# EAGLE design LTC2495Shield (EAGLE 7.4.0)
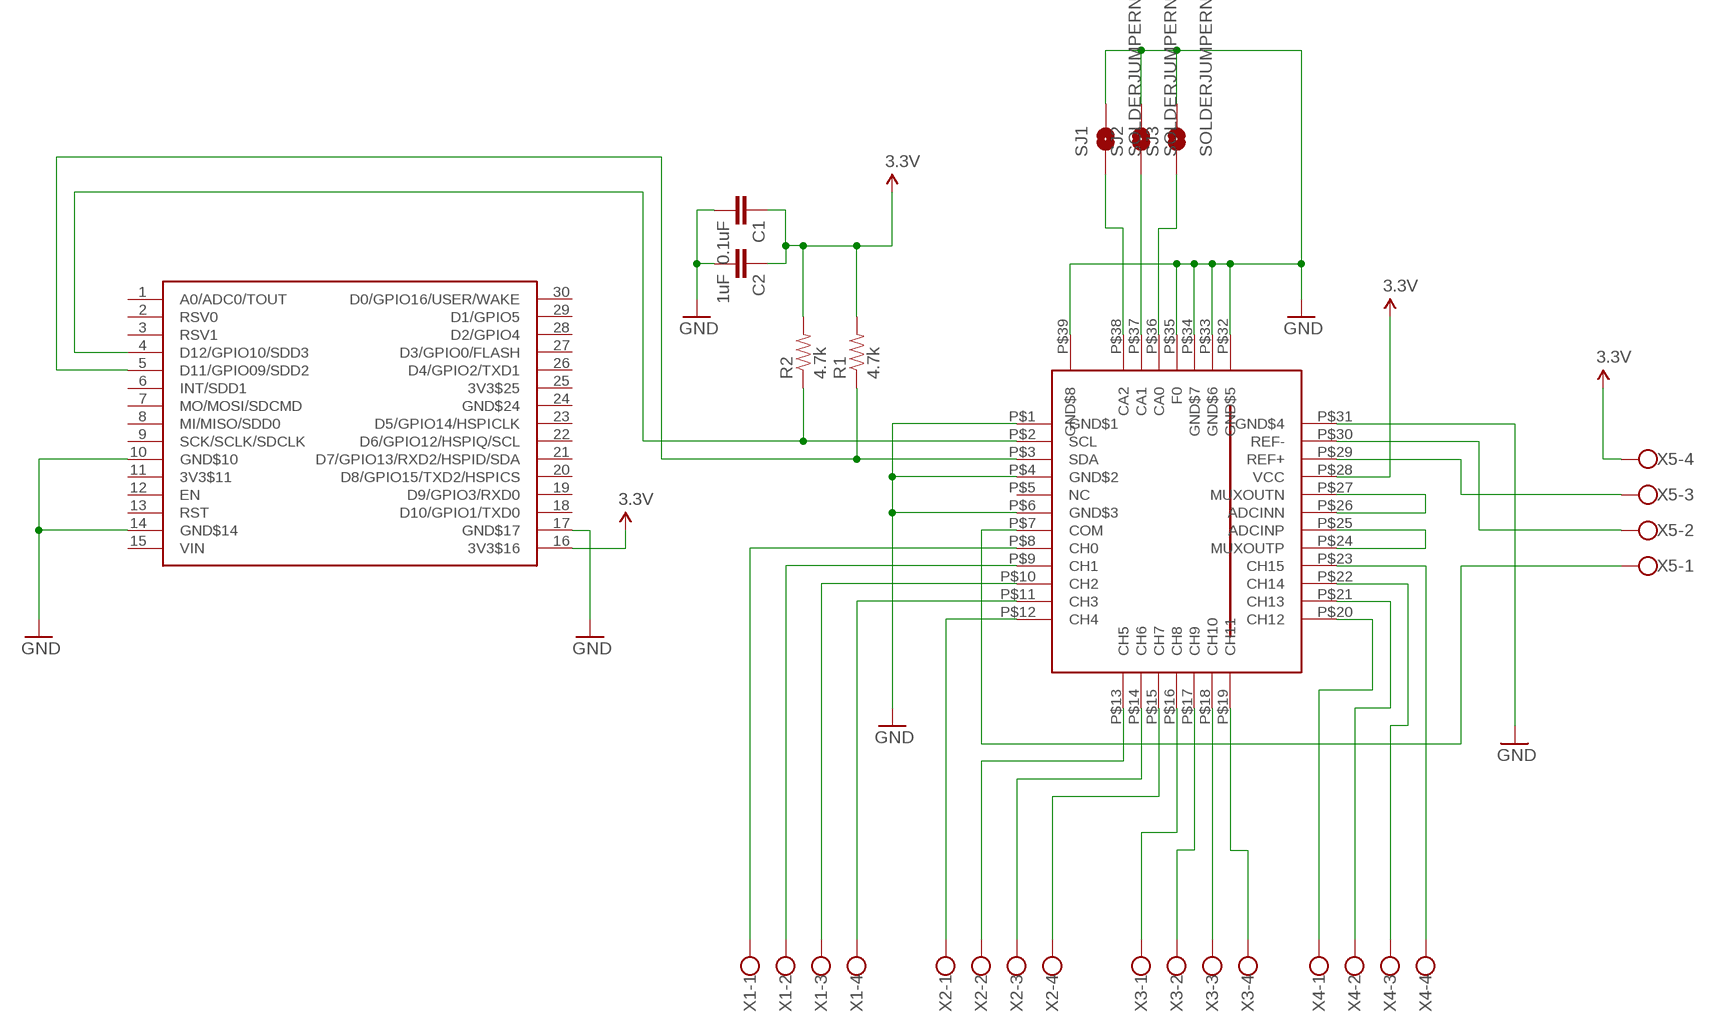
[diagram p0: schematic, sheet 1]

## Parts
C1  0.1uF  CAP0402-CAP  [0402-CAP]
C2  1uF  CAP0402-CAP  [0402-CAP]
R1  4.7k  RESISTOR0402-RES  [0402-RES]
R2  4.7k  RESISTOR0402-RES  [0402-RES]
SJ1  SOLDERJUMPERNO  [SJ_2S-NO]
SJ2  SOLDERJUMPERNO  [SJ_2S-NO]
SJ3  SOLDERJUMPERNO  [SJ_2S-NO]
U$1  NERDSHIELD  [NERDUINO_STACK]
U$3  LTC2495  [UHF38]
X1  W237-4  [W237-4]
X2  W237-4  [W237-4]
X3  W237-4  [W237-4]
X4  W237-4  [W237-4]
X5  W237-4  [W237-4]

## Nets
3.3V: C1.1 C2.1 R1.2 R2.2 U$1.16(3V3$16) U$3.P$28(VCC) X5.4
GND: C1.2 C2.2 SJ1.2 SJ2.2 SJ3.2 U$1.10(GND$10) U$1.14(GND$14) U$1.17(GND$17) U$3.P$1(GND$1) U$3.P$4(GND$2) U$3.P$6(GND$3) U$3.P$31(GND$4) U$3.P$32(GND$5) U$3.P$33(GND$6) U$3.P$34(GND$7) U$3.P$35(F0) U$3.P$39(GND$8)
N$2: R1.1 U$1.5(D11/GPIO09/SDD2) U$3.P$3(SDA)
N$3: U$3.P$8(CH0) X1.1
N$4: U$3.P$9(CH1) X1.2
N$5: U$3.P$10(CH2) X1.3
N$6: U$3.P$11(CH3) X1.4
N$7: U$3.P$12(CH4) X2.1
N$8: R2.1 U$1.4(D12/GPIO10/SDD3) U$3.P$2(SCL)
N$9: U$3.P$13(CH5) X2.2
N$10: U$3.P$14(CH6) X2.3
N$11: U$3.P$15(CH7) X2.4
N$12: U$3.P$16(CH8) X3.1
N$13: U$3.P$17(CH9) X3.2
N$14: U$3.P$18(CH10) X3.3
N$15: U$3.P$19(CH11) X3.4
N$16: U$3.P$20(CH12) X4.1
N$17: U$3.P$21(CH13) X4.2
N$18: U$3.P$22(CH14) X4.3
N$19: U$3.P$23(CH15) X4.4
N$20: SJ1.1 U$3.P$38(CA2)
N$21: SJ2.1 U$3.P$37(CA1)
N$22: SJ3.1 U$3.P$36(CA0)
N$25: U$3.P$7(COM) X5.1
N$26: U$3.P$29(REF+) X5.3
N$27: U$3.P$30(REF-) X5.2
N$28: U$3.P$26(ADCINN) U$3.P$27(MUXOUTN)
N$29: U$3.P$24(MUXOUTP) U$3.P$25(ADCINP)
Unconnected: U$1.1(A0/ADC0/TOUT) U$1.2(RSV0) U$1.3(RSV1) U$1.6(INT/SDD1) U$1.7(MO/MOSI/SDCMD) U$1.8(MI/MISO/SDD0) U$1.9(SCK/SCLK/SDCLK) U$1.11(3V3$11) U$1.12(EN) U$1.13(RST) U$1.15(VIN) U$1.18(D10/GPIO1/TXD0) U$1.19(D9/GPIO3/RXD0) U$1.20(D8/GPIO15/TXD2/HSPICS) U$1.21(D7/GPIO13/RXD2/HSPID/SDA) U$1.22(D6/GPIO12/HSPIQ/SCL) U$1.23(D5/GPIO14/HSPICLK) U$1.24(GND$24) U$1.25(3V3$25) U$1.26(D4/GPIO2/TXD1) U$1.27(D3/GPIO0/FLASH) U$1.28(D2/GPIO4) U$1.29(D1/GPIO5) U$1.30(D0/GPIO16/USER/WAKE) U$3.P$5(NC)

## Library data of the parts
C1 C2 = SparkFun:CAP: Capacitor Standard 0603 ceramic capacitor, and 0.1" leaded capacitor.
R1 R2 = SparkFun:RESISTOR: Resistor Basic schematic elements and footprints for 0603, 1206, and PTH resistors.
SJ1-SJ3 = SparkFun:SOLDERJUMPER: Solder Jumper Standard SMD solder jumper. Used to automate production. Two varients : Normally Open and Normally Closed are the same, but have different paste layers. NC will have a large amount of paste and should jumper during reflow.
U$1 = NerduinoShieldLib:NERDSHIELD
U$3 = SparkFun-AnalogIC:LTC2495
X1-X5 = con-wago-500:W237-4: WAGO SCREW CLAMP; OC_FARNELL: unknown; OC_NEWARK: unknown

## Board
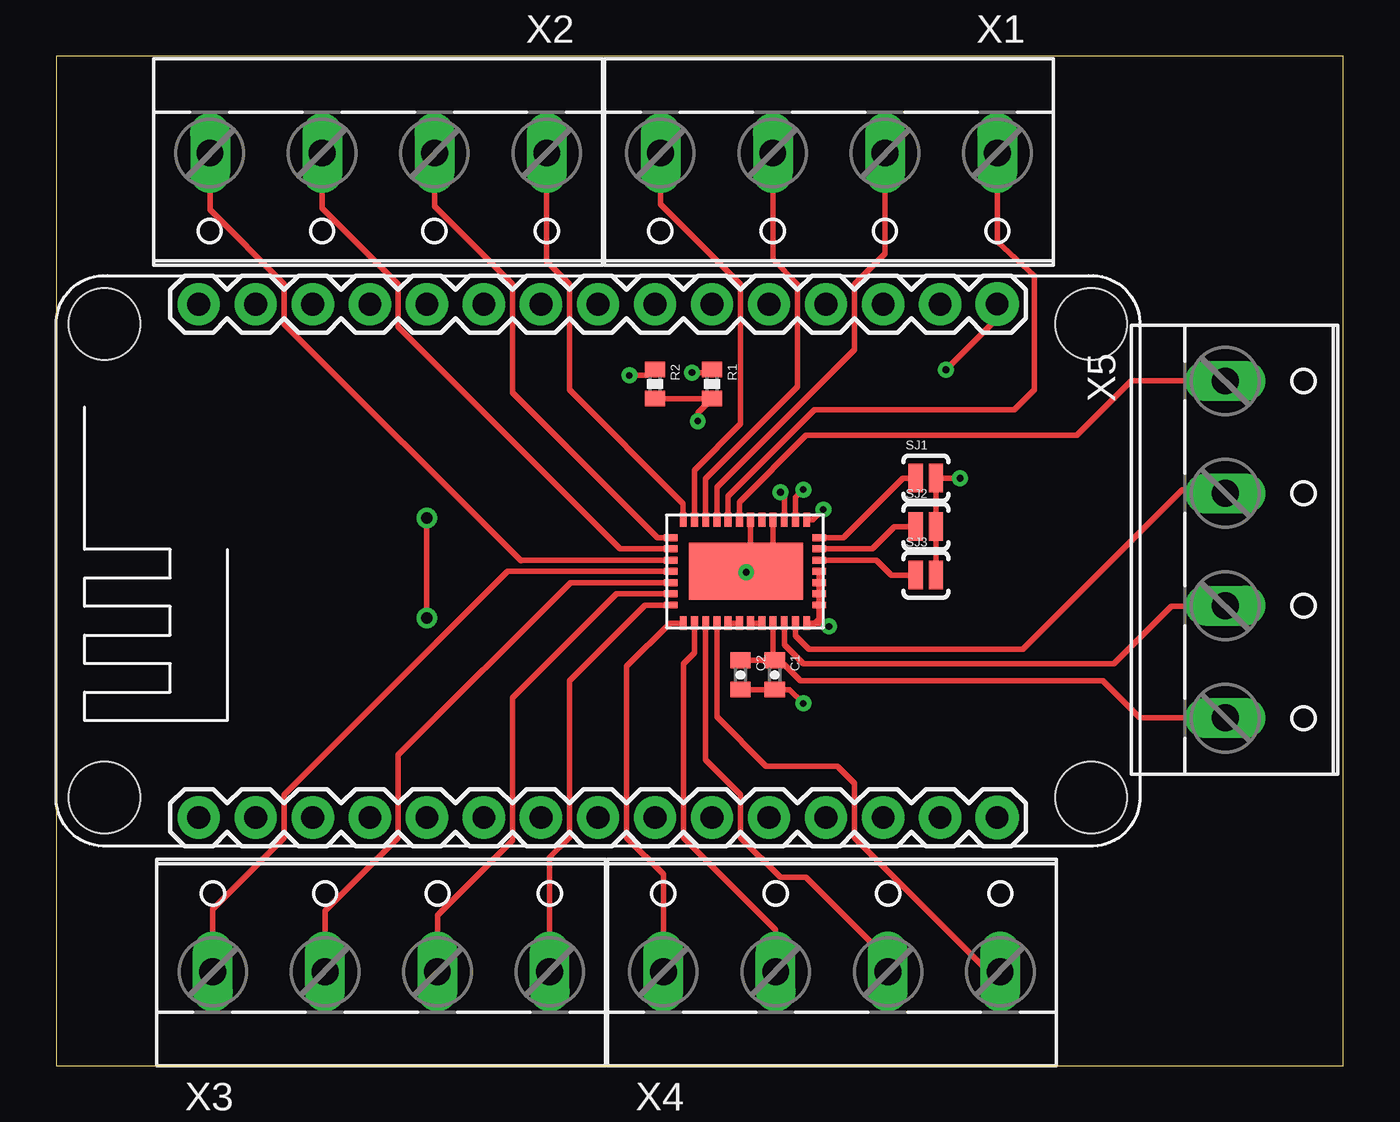
[diagram p1: board, top side]
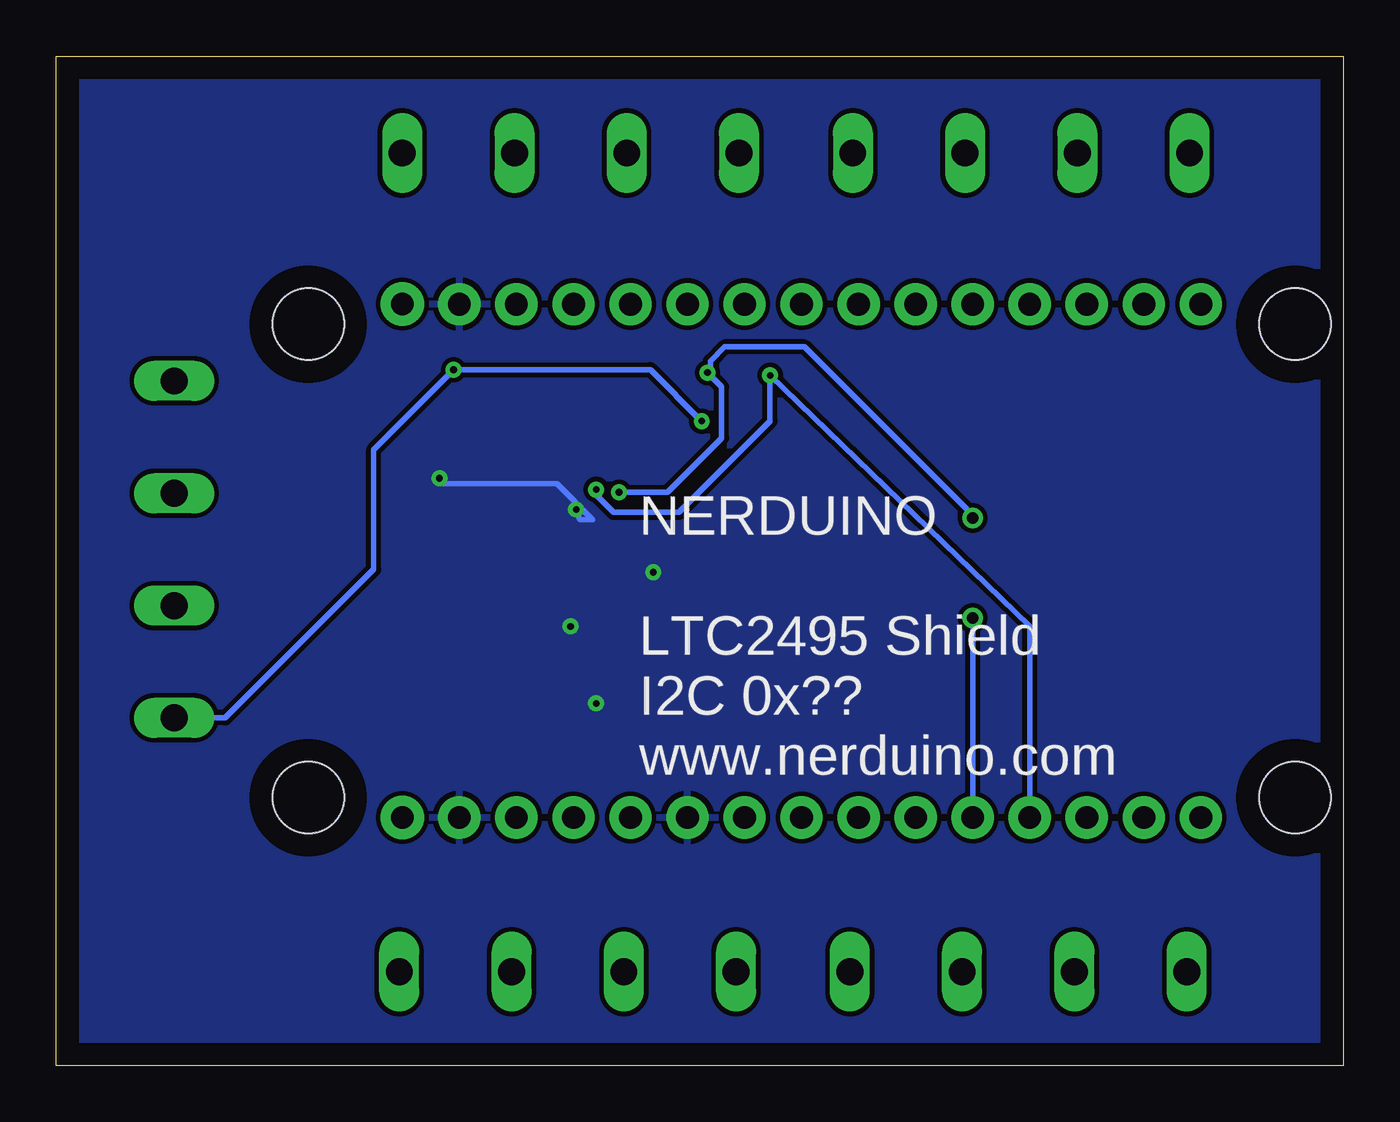
[diagram p2: board, bottom side, seen from below]

Size 57.33 x 44.95 mm. Coordinates in mm from the lower left corner, seen from the top.
Outline: 0,0 57.33,0 57.33,44.95 0,44.95 0,0
Copper layers (1*16): Top 0.035mm / dielectric 1.5mm / Bottom 0.035mm
Design rules "default": minimum track width 10mil, minimum drill 24mil, track to track 8mil, track to pad 8mil, pad to pad 8mil, via to via 8mil, smd to smd 8mil, copper to edge 40mil, drill to drill 8mil, minimum pad ring 10mil, minimum via ring 8mil, stop-mask expansion 4mil, vias tented up to drill 0mil, thermal gap 10mil

### Footprints (pad centres in the part's own frame; a part is rotated, then mirrored left to right if it is on the bottom)
0402-CAP = smd 0.7 x 0.9: 1 -0.65,0; 2 0.65,0
0402-RES = smd 0.7 x 0.9: 1 -0.65,0; 2 0.65,0
SJ_2S-NO = smd 0.635 x 1.27: 1 -0.45,0; 2 0.45,0
NERDUINO_STACK = drill 1.016 pad 1.88: 1 -17.78,-5.08; 2 -15.24,-5.08; 3 -12.7,-5.08; 4 -10.16,-5.08; 5 -7.62,-5.08; 6 -5.08,-5.08; 7 -2.54,-5.08; 8 0,-5.08; 9 2.54,-5.08; 10 5.08,-5.08; 11 7.62,-5.08; 12 10.16,-5.08; 13 12.7,-5.08; 14 15.24,-5.08; 17 15.24,17.78; 18 12.7,17.78; 19 10.16,17.78; 20 7.62,17.78; 21 5.08,17.78; 22 2.54,17.78; 23 0,17.78; 24 -2.54,17.78; 25 -5.08,17.78; 26 -7.62,17.78; 27 -10.16,17.78; 28 -12.7,17.78; 29 -15.24,17.78; 30 -17.78,17.78 | drill 1 pad 1.93: 15 17.78,-5.08; 16 17.78,17.78 | hole 3.175: -21.971,16.891; -21.971,-4.191; 21.971,-4.191; 21.971,16.891
UHF38 = smd 0.61 x 0.305: P$1 0.2,6.25; P$2 0.2,5.75; P$3 0.2,5.25; P$4 0.2,4.75; P$5 0.2,4.25; P$6 0.2,3.75; P$7 0.2,3.25; P$8 0.2,2.75; P$9 0.2,2.25; P$10 0.2,1.75; P$11 0.2,1.25; P$12 0.2,0.75; P$20 4.8,0.75; P$21 4.8,1.25; P$22 4.8,1.75; P$23 4.8,2.25; P$24 4.8,2.75; P$25 4.8,3.25; P$26 4.8,3.75; P$27 4.8,4.25; P$28 4.8,4.75; P$29 4.8,5.25; P$30 4.8,5.75; P$31 4.8,6.25 | smd 0.305 x 0.61: P$13 1,0.2; P$14 1.5,0.2; P$15 2,0.2; P$16 2.5,0.2; P$17 3,0.2; P$18 3.5,0.2; P$19 4,0.2; P$32 4,6.8; P$33 3.5,6.8; P$34 3,6.8; P$35 2.5,6.8; P$36 2,6.8; P$37 1.5,6.8; P$38 1,6.8 | smd 2.54 x 5.08: P$39 2.5,3.55
W237-4 = drill 1.194 long: 1 -7.5,-1.27; 2 -2.5,-1.27; 3 2.5,-1.27; 4 7.5,-1.27

### Placement (x,y rotation side)
C1  32,17.4 270 top
C2  30.48,17.4 270 top
R1  29.21,30.35 270 top
R2  26.67,30.35 270 top
SJ1  38.73,26.16 0 top
SJ2  38.73,24 0 top
SJ3  38.73,21.84 0 top
U$1  24.13,16.13 0 top
U$3  27.18,24.51 270 top
X1  34.42,39.37 180 top
X2  14.35,39.37 180 top
X3  14.48,5.46 0 top
X4  34.54,5.46 0 top
X5  53.34,22.99 270 top

### Tracks (layer width: path | path; a pad name or v marks a point on that pad's centre or on a via)
3.3V  (via drill 0.3)
  Top 0.254: R1.2 29.21,29.72 | C2.1 C1.1 | U$3.P$28 31.93,18.12 C1.1 | R2.2 R1.2 | U$1.16 41.91,33.27 v39.62,30.99 | v28.57,28.7 28.57,29.07 R1.2 | X5.4 48.27,15.49 46.61,17.14 33.15,17.14 32.38,17.91 32.15,17.91 C1.1
  Bottom 0.254: v28.57,28.7 30.86,30.99 v39.62,30.99 43.18,27.43 43.18,22.1 49.79,15.49 X5.4
GND  (via drill 0.3)
  Top 0.254: U$3.P$35 U$3.P$34 U$3.P$33 U$3.P$32 33.98,19.88 33.78,19.68 33.45,19.68 U$3.P$31 34.26,19.71 v34.42,19.56 | SJ3.2 SJ2.2 SJ1.2 v40.26,26.16 | U$3.P$1 33.71,24.31 v34.16,24.77 | U$3.P$39 v30.73,21.98 v30.73,21.97 | U$3.P$6 30.93,22.21 U$3.P$39 | U$3.P$4 31.93,23.21 U$3.P$39 | C2.2 C1.2 32.65,16.75 v33.27,16.13
  Bottom 0.254: v40.26,26.16 40.26,25.91 35.02,25.91 U$3.P$1 33.96,24.31 34.04,24.38 | v34.16,24.77 34.29,24.77 | v30.73,21.97 30.73,22.1 | v33.27,16.13 33.27,16.26 | v34.42,19.56 34.54,19.56
  pour Bottom: 0.25,44.83 57.02,44.7 57.02,0.25 0.25,0.38
N$2  (via drill 0.3, 0.5)
  Top 0.254: U$3.P$3 32.43,25.36 v32.26,25.53 | v28.32,30.86 29.07,30.86 R1.1 | v16.51,19.94 v16.51,24.38
  Bottom 0.254: v32.26,25.53 30.1,25.53 27.69,27.94 27.69,30.23 v28.32,30.86 28.19,30.99 28.19,31.37 27.56,32 24,32 16.51,24.51 v16.51,24.38 | U$1.5 v16.51,19.94
N$3
  Top 0.254: X1.1 41.92,36.7 43.56,35.18 43.56,30.1 42.67,29.21 33.78,29.21 29.93,25.36 U$3.P$8
N$4
  Top 0.254: X1.2 36.92,36.16 35.56,34.8 35.56,31.88 29.43,25.75 U$3.P$9
N$5
  Top 0.254: X1.3 31.92,35.9 33.02,34.8 33.02,30.23 28.93,26.13 U$3.P$10
N$6
  Top 0.254: X1.4 26.92,38.36 30.48,34.8 30.48,28.57 28.43,26.52 U$3.P$11
N$7
  Top 0.254: X2.1 21.85,35.81 22.86,34.8 22.86,30.1 27.93,25.03 U$3.P$12
N$8  (via drill 0.3)
  Top 0.254: U$3.P$2 32.93,25.31 v33.27,25.65 | v25.53,30.73 26.4,30.73 R2.1
  Bottom 0.254: v33.27,25.65 33.4,25.53 32.51,24.64 29.59,24.64 25.53,28.7 v25.53,30.73 13.97,19.56 U$1.4
N$9
  Top 0.254: X2.2 16.85,38.27 20.32,34.8 20.32,29.97 26.78,23.51 U$3.P$13
N$10
  Top 0.254: X2.3 11.85,38.19 15.24,34.8 15.24,32.89 25.12,23.01 U$3.P$14
N$11
  Top 0.254: X2.4 6.85,38.11 10.16,34.8 10.16,33.02 20.7,22.48 20.73,22.51 U$3.P$15
N$12
  Top 0.254: X3.1 6.98,6.98 10.16,10.16 10.16,12.06 20.11,22.01 U$3.P$16
N$13
  Top 0.254: X3.2 11.98,6.9 15.24,10.16 15.24,13.84 22.91,21.51 U$3.P$17
N$14
  Top 0.254: X3.3 16.98,6.69 20.32,10.03 20.32,16.38 24.95,21.01 U$3.P$18
N$15
  Top 0.254: X3.4 21.98,9.28 22.86,10.16 22.86,17.14 26.23,20.51 U$3.P$19
N$16
  Top 0.254: X4.1 27.04,8.52 25.4,10.16 25.4,17.78 27.33,19.71 U$3.P$20
N$17
  Top 0.254: X4.2 32.04,6.06 27.94,10.16 27.94,17.91 28.43,18.39 U$3.P$21
N$18
  Top 0.254: X4.3 37.04,4.74 33.4,8.38 32.26,8.38 30.48,10.16 30.48,12.06 28.93,13.62 U$3.P$22
N$19
  Top 0.254: X4.4 41.53,4.19 35.56,10.16 35.56,12.57 34.8,13.33 31.62,13.33 29.43,15.53 U$3.P$23
N$20
  Top 0.254: U$3.P$38 35.07,23.51 37.72,26.16 SJ1.1
N$21
  Top 0.254: U$3.P$37 36.35,23.01 37.34,24 SJ2.1
N$22
  Top 0.254: U$3.P$36 36.54,22.51 37.21,21.84 SJ3.1
N$25
  Top 0.254: X5.1 47.89,30.49 45.47,28.07 33.4,28.07 30.43,25.09 U$3.P$7
N$26
  Top 0.254: U$3.P$29 32.43,18.75 33.27,17.91 47.12,17.91 49.66,20.45 52.03,20.45 X5.3
N$27
  Top 0.254: U$3.P$30 32.93,19.14 33.53,18.54 43.05,18.54 50.16,25.65 51.9,25.65 X5.2
N$28
  Top 0.254: U$3.P$27 U$3.P$26
N$29
  Top 0.254: U$3.P$24 U$3.P$25

### Text on the board
_bsilk: NERDUINO / / LTC2495 Shield / I2C 0x?? / www.nerduino.com